# EAGLE design PCB (EAGLE 9.6.2)
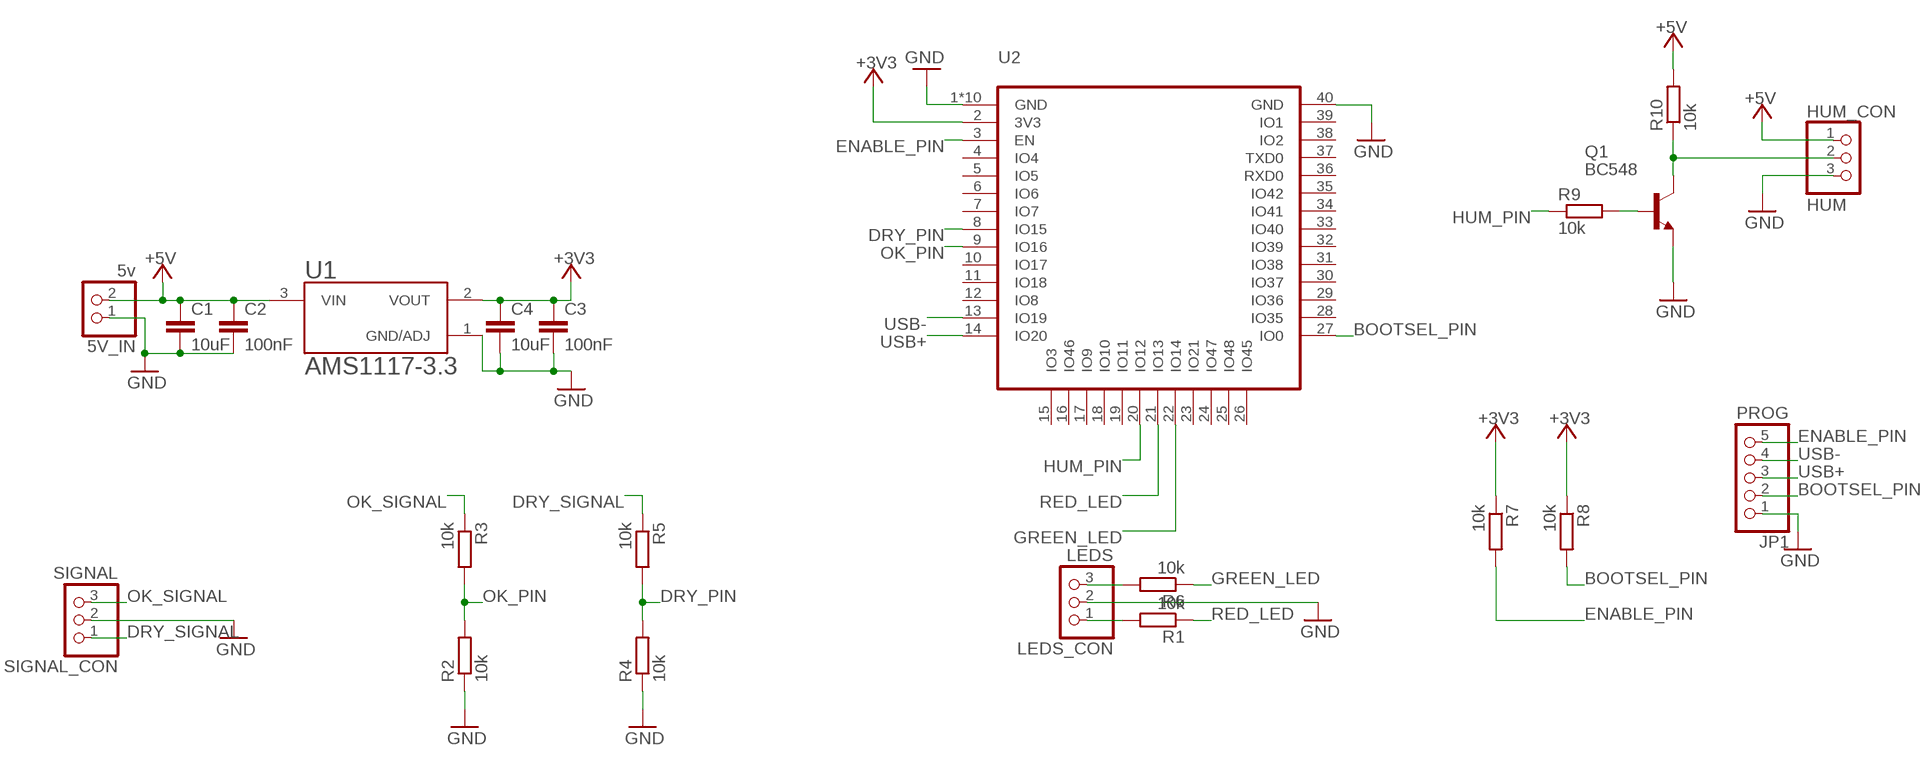
[diagram p0: schematic, sheet 1]

## Parts
5V_IN  5v  PINHD-1X2  [1X02]
C1  10uF  C-EUC1206  [C1206]
C2  100nF  C-EUC1206  [C1206]
C3  100nF  C-EUC1206  [C1206]
C4  10uF  C-EUC1206  [C1206]
HUM_CON  HUM  PINHD-1X3  [1X03]
JP1  PROG  PINHD-1X5  [1X05]
LEDS_CON  LEDS  PINHD-1X3  [1X03]
Q1  BC548  [TO92-EBC]
R1  10k  R-EU_R1206  [R1206]
R2  10k  R-EU_R1206  [R1206]
R3  10k  R-EU_R1206  [R1206]
R4  10k  R-EU_R1206  [R1206]
R5  10k  R-EU_R1206  [R1206]
R6  10k  R-EU_R1206  [R1206]
R7  10k  R-EU_R1206  [R1206]
R8  10k  R-EU_R1206  [R1206]
R9  10k  R-EU_R1206  [R1206]
R10  10k  R-EU_R1206  [R1206]
SIGNAL_CON  SIGNAL  PINHD-1X3  [1X03]
U1  AMS1117-3.3  [SOT229P700X180-4N]
U2  ESP32-S3-WROOM-1  [ESP32-S3-WROOM-1]

## Nets
+3V3: C3.1 C4.1 R7.1 R8.1 U1.2(VOUT) U2.2(3V3)
+5V: 5V_IN.2 C1.1 C2.1 HUM_CON.1 R10.2 U1.3(VIN)
BOOTSEL_PIN: JP1.2 R8.2 U2.27(IO0)
DRY_PIN: R4.2 R5.2 U2.8(IO15)
DRY_SIGNAL: R5.1 SIGNAL_CON.1
ENABLE_PIN: JP1.5 R7.2 U2.3(EN)
GND: 5V_IN.1 C1.2 C2.2 C3.2 C4.2 HUM_CON.3 JP1.1 LEDS_CON.2 Q1.E R2.1 R4.1 SIGNAL_CON.2 U1.1(GND/ADJ) U2.1(GND) U2.40(GND) U2.P$1(GND) U2.P$2(GND) U2.P$3(GND) U2.P$4(GND) U2.P$5(GND) U2.P$6(GND) U2.P$7(GND) U2.P$8(GND) U2.P$9(GND)
GREEN_LED: R6.1 U2.22(IO14)
HUM_PIN: R9.1 U2.20(IO12)
N$1: LEDS_CON.3 R6.2
N$2: LEDS_CON.1 R1.2
N$3: Q1.B R9.2
N$4: HUM_CON.2 Q1.C R10.1
OK_PIN: R2.2 R3.2 U2.9(IO16)
OK_SIGNAL: R3.1 SIGNAL_CON.3
RED_LED: R1.1 U2.21(IO13)
USB+: JP1.3 U2.14(IO20)
USB-: JP1.4 U2.13(IO19)
Unconnected: U2.4(IO4) U2.5(IO5) U2.6(IO6) U2.7(IO7) U2.10(IO17) U2.11(IO18) U2.12(IO8) U2.15(IO3) U2.16(IO46) U2.17(IO9) U2.18(IO10) U2.19(IO11) U2.23(IO21) U2.24(IO47) U2.25(IO48) U2.26(IO45) U2.28(IO35) U2.29(IO36) U2.30(IO37) U2.31(IO38) U2.32(IO39) U2.33(IO40) U2.34(IO41) U2.35(IO42) U2.36(RXD0) U2.37(TXD0) U2.38(IO2) U2.39(IO1)

## Library data of the parts
5V_IN = pinhead:PINHD-1X2: PIN HEADER
C1-C4 = rcl:C-EU: CAPACITOR, European symbol; SPICEPREFIX: C
HUM_CON LEDS_CON SIGNAL_CON = pinhead:PINHD-1X3: PIN HEADER
JP1 = pinhead:PINHD-1X5: PIN HEADER
Q1 = transistor-npn:BC548*: NPN Transistor
R1-R10 = rcl:R-EU_: RESISTOR, European symbol; SPICEPREFIX: R
U1 = AMS1117-3.3:AMS1117-3.3: Check availability <https://pricing.snapeda.com/parts/AMS1117-3.3/Advanced%20Monolithic%20Systems/view-part?ref=eda>; AVAILABILITY: Not in stock; CHECK_PRICES: https://www.snapeda.com/parts/AMS1117-3.3/Advanced+Monolithic+Systems/view-part/?ref=eda; DESCRIPTION: Sot223/Pkg 1-Amp 3.3-Volt Low Drop Out Voltage Regulatator; MF: Advanced Monolithic Systems; MP: AMS1117-3.3; PACKAGE: SOT-223 Seeed Technology; PRICE: None; SNAPEDA_LINK: https://www.snapeda.com/parts/AMS1117-3.3/Advanced+Monolithic+Systems/view-part/?ref=snap
U2 = ESP32-S3-WROOM-1:ESP32-S3-WROOM-1: ESP32-S3-WROOM-1 WiFi Module Check availability <https://pricing.snapeda.com/parts/ESP32-S3-WROOM-1/Espressif%20Systems/view-part?ref=eda>; AVAILABILITY: In Stock; DESCRIPTION: SMD MODULE, ESP32-S3R8 WITH 8 MB; MF: Espressif Systems; MP: ESP32-S3-WROOM-1; PACKAGE: None; PRICE: None; PURCHASE-URL: https://pricing.snapeda.com/search/part/ESP32-S3-WROOM-1/?ref=eda

## Board
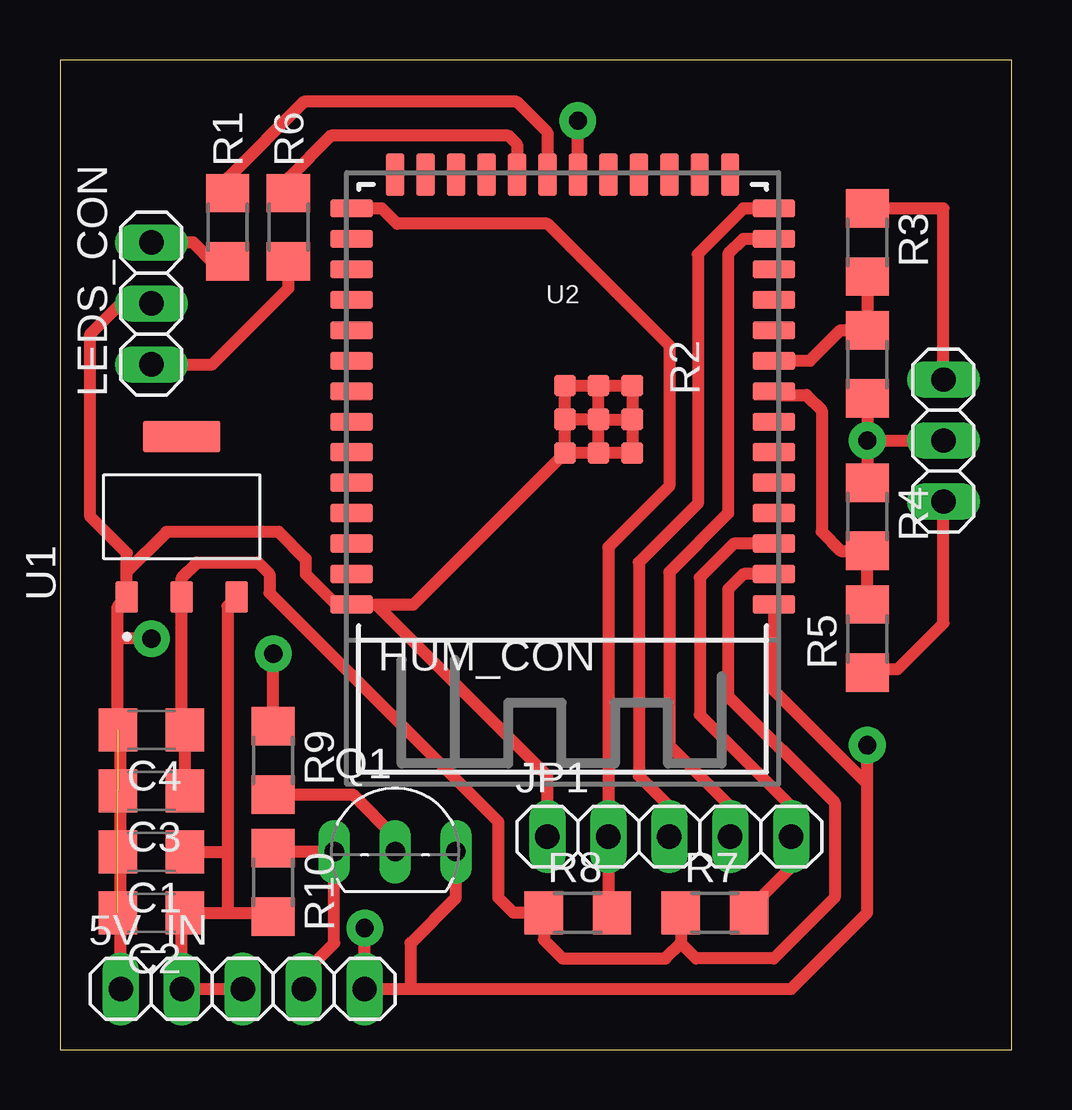
[diagram p1: board, top side]
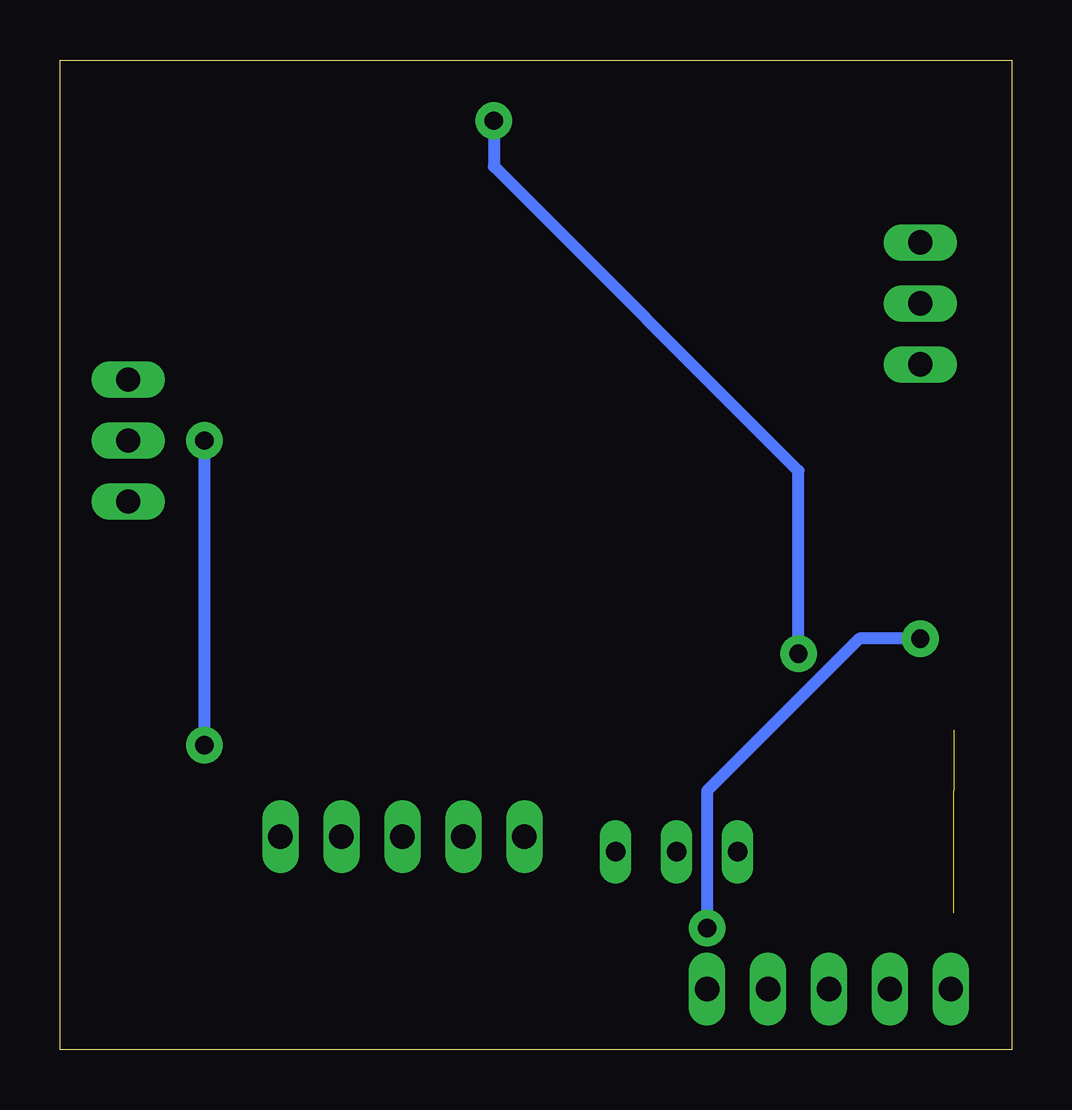
[diagram p2: board, bottom side, seen from below]

Size 39.67 x 41.27 mm. Coordinates in mm from the lower left corner, seen from the top.
Outline: 0,0 39.67,0 39.67,41.27 0,41.27 0,0
Copper layers (1*16): Top 0.035mm / dielectric 1.5mm / Bottom 0.035mm
Design rules "default": minimum track width 6mil, minimum drill 0.35mm, track to track 6mil, track to pad 6mil, pad to pad 6mil, via to via 6mil, smd to smd 6mil, copper to edge 40mil, drill to drill 6mil, minimum pad ring 10mil, minimum via ring 8mil, stop-mask expansion 4mil, vias tented up to drill 0mil, thermal gap 10mil

### Footprints (pad centres in the part's own frame; a part is rotated, then mirrored left to right if it is on the bottom)
1X02 = drill 1.016 long: 1 -1.27,0; 2 1.27,0
C1206 = smd 1.6 x 1.8: 1 -1.4,0; 2 1.4,0
1X03 = drill 1.016 long: 1 -2.54,0; 2 0,0; 3 2.54,0
1X05 = drill 1.016 long: 1 -5.08,0; 2 -2.54,0; 3 0,0; 4 2.54,0; 5 5.08,0
TO92-EBC = drill 0.813 long: B 0,-1.27; C -2.54,-1.27; E 2.54,-1.27
R1206 = smd 1.6 x 1.803: 1 -1.422,0; 2 1.422,0
SOT229P700X180-4N = smd 1.31 x 0.93: 1 -3.345,2.29; 2 -3.345,0; 3 -3.345,-2.29 | smd 1.31 x 3.24: 4 3.345,0
ESP32-S3-WROOM-1 = smd 1.778 x 0.762: 1 -8.804,10.01; 2 -8.804,8.74; 3 -8.804,7.47; 4 -8.804,6.2; 5 -8.804,4.93; 6 -8.804,3.66; 7 -8.804,2.39; 8 -8.804,1.12; 9 -8.804,-0.15; 10 -8.804,-1.42; 11 -8.804,-2.69; 12 -8.804,-3.96; 13 -8.804,-5.23; 14 -8.804,-6.5; 27 8.804,-6.5; 28 8.804,-5.23; 29 8.804,-3.96; 30 8.804,-2.69; 31 8.804,-1.42; 32 8.804,-0.15; 33 8.804,1.12; 34 8.804,2.39; 35 8.804,3.66; 36 8.804,4.93; 37 8.804,6.2; 38 8.804,7.47; 39 8.804,8.74; 40 8.804,10.01 | smd 0.762 x 1.778: 15 -6.985,-7.904; 16 -5.715,-7.904; 17 -4.445,-7.904; 18 -3.175,-7.904; 19 -1.905,-7.904; 20 -0.635,-7.904; 21 0.635,-7.904; 22 1.905,-7.904; 23 3.175,-7.904; 24 4.445,-7.904; 25 5.715,-7.904; 26 6.985,-7.904 | smd 0.9 x 0.9: P$1 -2.9,3.69; P$2 -1.5,3.69; P$3 -0.1,3.69; P$4 -2.9,2.29; P$5 -1.5,2.29; P$6 -0.1,2.29; P$7 -2.9,0.89; P$8 -1.5,0.89; P$9 -0.1,0.89

### Placement (x,y rotation side)
5V_IN  3.81,2.54 0 top
C1  3.81,8.26 180 top
C2  3.81,5.71 180 top
C3  3.81,10.79 180 top
C4  3.81,13.34 180 top
HUM_CON  10.16,2.54 0 top
JP1  25.4,8.89 0 top
LEDS_CON  3.81,31.11 270 top
Q1  13.97,9.53 0 top
R1  6.99,34.29 270 top
R2  33.66,28.57 90 top
R3  33.66,33.66 270 top
R4  33.66,22.23 270 top
R5  33.66,17.14 90 top
R6  9.53,34.29 270 top
R7  27.3,5.71 0 top
R8  21.59,5.71 0 top
R9  8.89,12.06 270 top
R10  8.89,6.99 270 top
SIGNAL_CON  36.83,25.4 90 top
U1  5.08,22.23 90 top
U2  20.95,28.57 180 top

### Tracks (layer width: path | path; a pad name or v marks a point on that pad's centre or on a via)
+3V3
  Top 0.508: C3.1 C4.1 5.21,13.97 5.08,14.1 U1.2 5.08,19.68 5.71,20.32 8.26,20.32 8.74,19.84 8.74,19.05 18.26,9.53 18.26,6.35 18.9,5.71 R8.1 20.17,4.6 20.95,3.81 25.25,3.81 25.88,4.45 | U2.2 28.49,19.84 27.85,19.2 27.85,14.76 32.3,10.31 32.3,6.35 29.76,3.81 26.52,3.81 25.88,4.45 | R7.1 25.88,4.45
+5V
  Top 0.508: 6.99,8.26 6.99,5.71 | U1.3 6.99,18.5 6.99,8.26 | 6.99,5.71 C2.1 5.08,5.58 5V_IN.2 HUM_CON.1 | C1.1 6.99,8.26 | 6.99,5.71 8.74,5.71 R10.2
BOOTSEL_PIN
  Top 0.508: U2.27 13.42,35.08 14.06,34.44 20.32,34.44 25.4,29.36 25.4,23.5 22.86,20.95 JP1.2 22.86,5.87 R8.2
DRY_PIN
  Top 0.508: U2.8 29.91,27.3 31.11,27.3 31.75,26.67 31.75,21.59 32.54,20.8 R4.2 R5.2
DRY_SIGNAL
  Top 0.508: R5.1 33.81,15.88 34.92,15.88 36.83,17.78 SIGNAL_CON.1
ENABLE_PIN
  Top 0.508: U2.3 28.09,21.11 26.67,19.68 26.67,13.97 30.48,10.16 JP1.5 30.48,7.62 28.73,5.87 R7.2
GND  (via drill 0.76 pad 1.52)  (3 unrouted)
  Top 0.508: 5V_IN.1 2.54,13.34 C4.2 2.41,17.14 | JP1.1 20.32,11.43 13.19,18.57 U2.40 | 2.79,19.93 U1.1 2.41,18.5 2.41,17.14 | 2.79,19.93 4.45,21.59 9.13,21.59 10.25,20.47 10.25,19.84 11.52,18.57 U2.40 | 2.79,19.93 2.79,20.7 1.27,22.23 1.27,29.84 2.54,31.11 LEDS_CON.2 | 14.61,2.54 HUM_CON.3 v12.7,5.08 | 14.61,2.54 14.61,4.45 16.51,6.35 Q1.E | 33.66,11.1 33.66,5.71 30.48,2.54 14.61,2.54 | 33.66,11.1 29.76,14.99 U2.1 | U2.40 14.73,18.57 U2.P$3 | R2.1 v33.66,25.4 | v33.66,25.4 R4.1 | 33.66,11.1 v33.66,12.7 | U2.P$3 U2.P$6 | U2.P$6 U2.P$9 U2.P$8 | U2.P$8 U2.P$7 U2.P$4 | U2.P$4 U2.P$1 U2.P$2 | U2.P$2 U2.P$3 | U2.P$2 U2.P$5 | U2.P$5 U2.P$8 | U2.P$5 U2.P$6 | U2.P$5 U2.P$4 | v3.81,17.14 2.41,17.14 | v33.66,25.4 SIGNAL_CON.2
  Bottom 0.508: v3.81,17.14 6.35,17.14 12.7,10.79 v12.7,5.08 | v33.66,25.4 v33.66,12.7
GREEN_LED
  Top 0.508: U2.22 19.05,37.75 18.7,38.1 11.28,38.1 9.53,36.35 R6.1
HUM_PIN  (via drill 0.76 pad 1.52)
  Top 0.508: R9.1 v8.89,16.51 | U2.20 v21.59,38.73
  Bottom 0.508: v21.59,38.73 21.59,36.83 8.89,24.13 v8.89,16.51
N$1
  Top 0.508: LEDS_CON.3 6.35,28.57 9.53,31.75 R6.2
N$2
  Top 0.508: R1.2 6.35,32.87 5.56,33.66 LEDS_CON.1
N$3
  Top 0.508: Q1.B 13.97,8.89 12.22,10.64 R9.2
N$4
  Top 0.508: R10.1 9.53,8.41 9.68,8.26 Q1.C 11.43,4.45 10.16,3.17 HUM_CON.2
OK_PIN
  Top 0.508: R3.2 R2.2 32.54,30 31.27,28.73 U2.9
OK_SIGNAL
  Top 0.508: R3.1 36.83,35.08 SIGNAL_CON.3
RED_LED
  Top 0.508: R1.1 6.99,36.35 10.16,39.52 19.05,39.52 20.32,38.25 U2.21
USB+
  Top 0.508: U2.14 28.49,35.08 26.58,33.17 26.58,22.77 24.13,20.32 24.13,11.43 25.4,10.16 JP1.3
USB-
  Top 0.508: U2.13 28.49,33.8 27.85,33.17 27.85,22.38 25.4,19.92 25.4,12.7 27.94,10.16 JP1.4